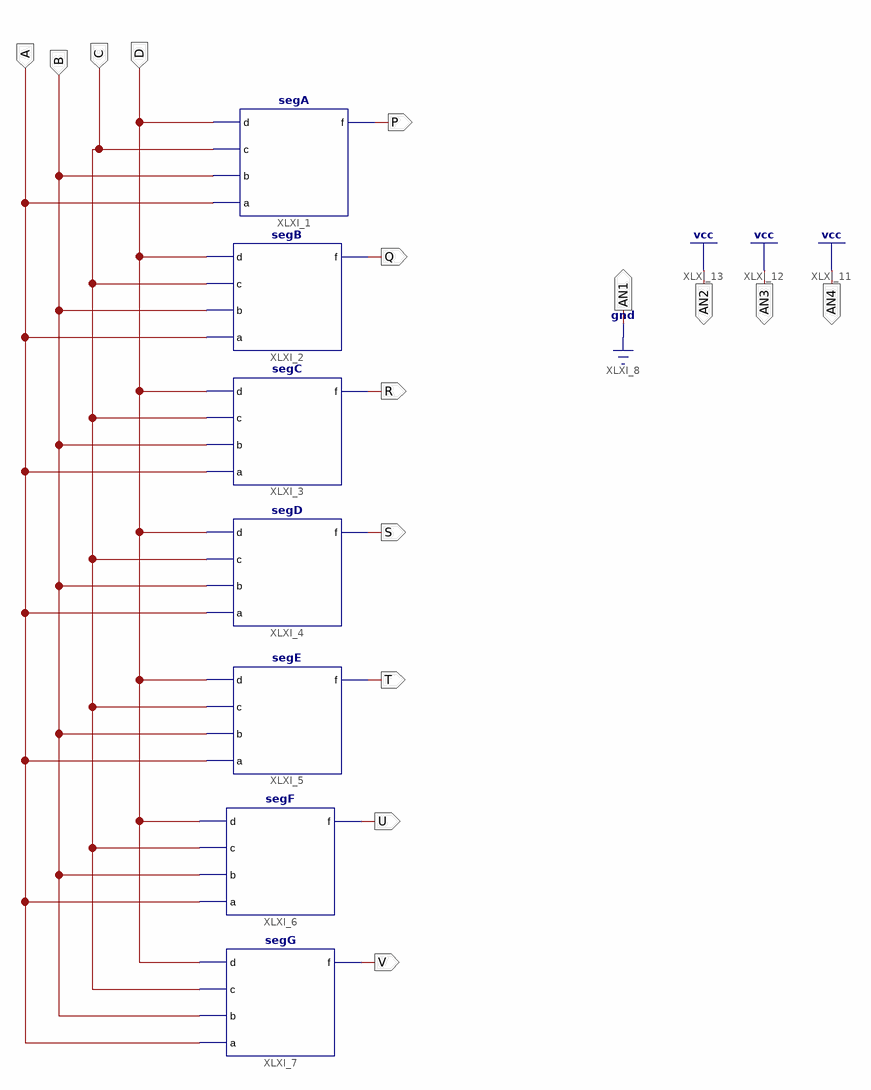
[diagram p0: schematic sheet 1]
// Xilinx ISE schematic seg.sch (spartan3e) as structural Verilog: 7 symbols, 15 ports
module seg (
  input  D,
  input  C,
  input  B,
  input  A,
  output P,
  output R,
  output S,
  output T,
  output U,
  output V,
  output Q,
  output AN1,
  output AN2,
  output AN3,
  output AN4
);

  segA XLXI_1 (.d(D), .c(C), .b(B), .a(A), .f(P));
  segB XLXI_2 (.d(D), .c(C), .b(B), .a(A), .f(Q));
  segC XLXI_3 (.d(D), .c(C), .b(B), .a(A), .f(R));
  segD XLXI_4 (.d(D), .c(C), .b(B), .a(A), .f(S));
  segE XLXI_5 (.d(D), .c(C), .b(B), .a(A), .f(T));
  segF XLXI_6 (.d(D), .c(C), .b(B), .a(A), .f(U));
  segG XLXI_7 (.d(D), .c(C), .b(B), .a(A), .f(V));

  assign AN1 = 1'b0;
  assign AN2 = 1'b1;
  assign AN3 = 1'b1;
  assign AN4 = 1'b1;
endmodule
